# EAGLE design rev1 (EAGLE 9.2.0)
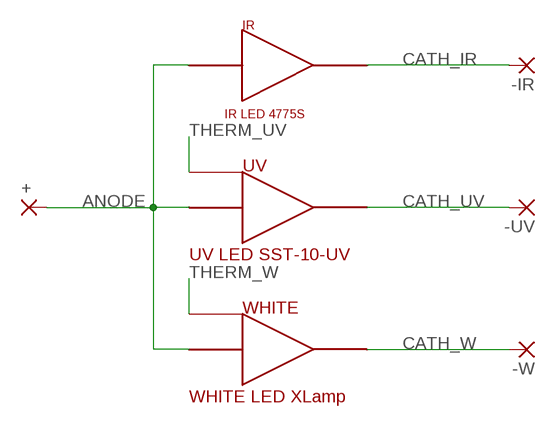
[diagram p0: schematic, sheet 1]

## Parts
+  SMD5  [SMD2,54-5,08]
-IR  SMD5  [SMD2,54-5,08]
-UV  SMD5  [SMD2,54-5,08]
-W  SMD5  [SMD2,54-5,08]
IR  4775S  [4775S]
UV  SST-10-UV  [LED]
WHITE  XLAMPXPG2  [LED]

## Nets
ANODE: +.1(P) IR.ANODE IR.ANODE1(ANODE) IR.ANODE2(ANODE) UV.ANODE WHITE.ANODE
CATH_IR: -IR.1(P) IR.CATHODE IR.CATHODE1(CATHODE)
CATH_UV: -UV.1(P) UV.CATHODE
CATH_W: -W.1(P) WHITE.CATHODE
THERM_UV: UV.THERM
THERM_W: WHITE.THERM

## Library data of the parts
+ -IR -UV -W = wirepad:SMD5: SMD PAD
IR = SFH 4775S:4775S
UV = 1414Cathode:SST-10-UV
WHITE = 1414Anode:XLAMPXPG2

## Board
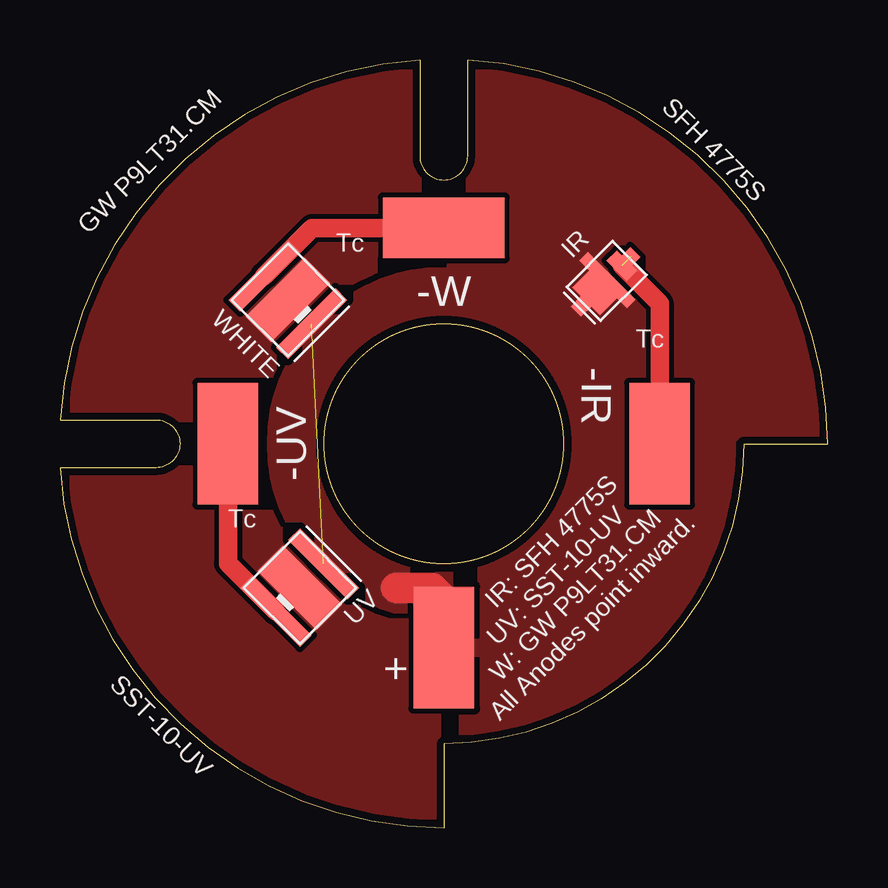
[diagram p1: board, top side]

Size 32 x 32 mm. Coordinates in mm from the lower left corner, seen from the top.
Outline: 28.5,16 arc-90 16,3.5 16,0 arc-86 0,15 4,15 arc90 5,16 arc90 4,17 0,17 arc-83 15,32 15,28 arc90 16,27 arc90 17,28 17,32 arc-86 32,16 28.5,16
Outline: circle at 16,16 radius 5
Copper layers (1*16): Top 0.035mm / dielectric 1.5mm / Bottom 0.035mm
Design rules "default *": minimum track width 6mil, minimum drill 0.35mm, track to track 8mil, track to pad 8mil, pad to pad 8mil, via to via 8mil, smd to smd 8mil, copper to edge 12mil, drill to drill 6mil, minimum pad ring 10mil, minimum via ring 8mil, stop-mask expansion 4mil, vias tented up to drill 0mil, thermal gap 10mil

### Footprints (pad centres in the part's own frame; a part is rotated, then mirrored left to right if it is on the bottom)
SMD2,54-5,08 = smd 2.54 x 5.08: 1 0,0
4775S = smd 1.6 x 1: ANODE 0,1 | smd 0.6 x 0.6: ANODE1 0,1.8 | smd 2.8 x 0.5: ANODE2 0,0.25 | smd 1.2 x 0.6: CATHODE 0,-0.6 | smd 0.6 x 0.5: CATHODE1 0,-1.15
LED = smd 0.7 x 3.5: ANODE -1.4,0; CATHODE 1.4,0 | smd 1.5 x 3.5: THERM 0,0

### Placement (x,y rotation side)
+  16,7.5 180 top
-IR  25,16 180 top
-UV  7,16 180 top
-W  16,25 270 top
IR  23,23 135 top
UV  10,10 225 top
WHITE  9.5,22 135 top

### Tracks (layer width: path | path; a pad name or v marks a point on that pad's centre or on a via)
ANODE  (1 unrouted)
  Top 1.27: +.1 16,9.5 15.5,10 14,10
  pour Top: 16,9 17,9 17,-1 24.2,-1 32,6.5 32,16 22,16 arc90 16,23 arc90 9,16 arc90
  pour Top (rank 3, no thermals): 37,29 37,16.5 16.5,16.5 16.5,37 29,37
CATH_IR  (1 unrouted)
  Top 0.762: -IR.1 25,21.85 IR.CATHODE
CATH_UV
  Top 0.762: UV.CATHODE 7,11.02 -UV.1
CATH_W
  Top 0.762: -W.1 10.52,25 WHITE.CATHODE
THERM_UV
  pour Top (rank 3, no thermals): -5,5 -5,15.5 15.5,15.5 15.5,-5 5,-5
THERM_W
  pour Top (rank 3, no thermals): 5,37 15.5,37 15.5,16.5 -5,16.5 -5,27

### Text on the board
tPlace: GW P9LT31.CM | SFH 4775S | SST-10-UV
tNames: Tc | Tc | Tc | IR: SFH 4775S / UV: SST-10-UV / W: GW P9LT31.CM / All Anodes point inward.